# Altium schematic sheet 06 Audio-CODEC.SchDoc: CM4 IO
size 297 x 209 mm; Page Create Date: March  8, 1995; Page Number: 6; Page Size: A4; Comment: radxa_1010; Page Count: 19; RevCode: V1.10; Doc: 06 Audio-CODEC; DsnPath: D:\WMS\黄工\[RC126]CM4_IO_V1.10\[RC126]_V1.10\CM4 IO_V1.10.DSN; SchematicName: CM4 IO V1.10; PageName: 06 Audio-CODEC; PageSize: A4; TopSchematic: True
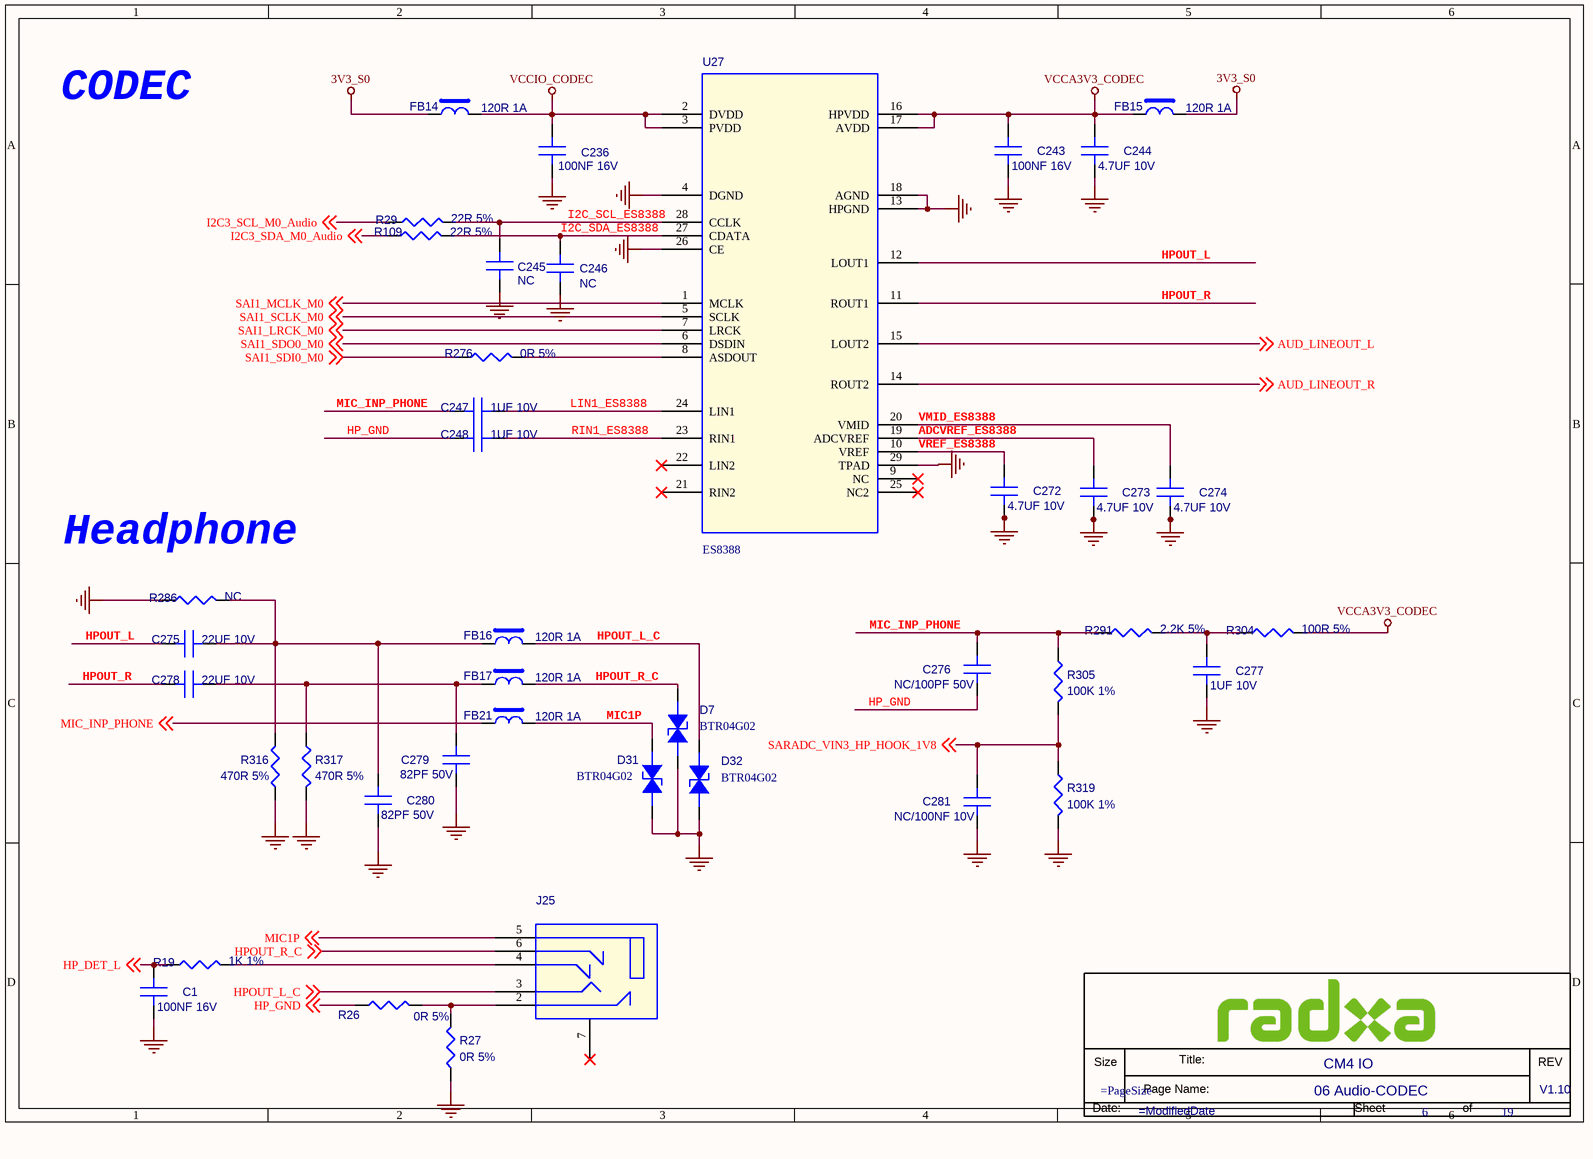
[diagram p0: 06 Audio-CODEC.SchDoc]

## Parts
*  Doc: 06 Audio-CODEC  RevCode: V1.10  Title: CM4 IO  Page Number: 6  Page Count: 19  (hidden comment: radxa_1010)  (graphical)
C1  100NF 16V  [C0201]
C236  100NF 16V  [C0201]
C243  100NF 16V  [C0201]
C244  4.7UF 10V  [C0402]
C245  NC  [C0201]
C246  NC  [C0201]
C247  1UF 10V  [C0201]
C248  1UF 10V  [C0201]
C272  4.7UF 10V  [C0402]
C273  4.7UF 10V  [C0402]
C274  4.7UF 10V  [C0402]
C275  22UF 10V  [C0603]
C276  NC/100PF 50V  [C0201]
C277  1UF 10V  [C0201]
C278  22UF 10V  [C0603]
C279  82PF 50V  [C0201]
C280  82PF 50V  [C0201]
C281  NC/100NF 10V  [C0201]
D7  BTR04G02  [DFN1006-2L]
D31  BTR04G02  [DFN1006-2L]
D32  BTR04G02  [DFN1006-2L]
FB14  120R 1A  [FB0201]
FB15  120R 1A  [FB0201]
FB16  120R 1A  [FB0201]
FB17  120R 1A  [FB0201]
FB21  120R 1A  [FB0201]
J25  (no value)  [AUDIO_SM6_LIE]
R19  1K 1%  [R0402]
R26  0R 5%  [R0402]
R27  0R 5%  [R0402]
R29  22R 5%  [R0402]
R109  22R 5%  [R0402]
R276  0R 5%  [R0402]
R286  NC  [R0402]
R291  2.2K 5%  [R0402]
R304  100R 5%  [R0402]
R305  100K 1%  [R0402]
R316  470R 5%  [R0402]
R317  470R 5%  [R0402]
R319  100K 1%  [R0402]
U27  ES8388  [QFN28_4X4]

## Nets
3V3_S0: FB14.1 FB15.1
GND: C1.2(B) C236.2(B) C243.2(B) C244.2(B) C245.2(B) C246.2(B) C272.2(B) C273.2(B) C274.2(B) C277.2(B) C279.2(B) C280.2(B) C281.2(B) D7.2(CATHODE) D31.2(CATHODE) D32.2(CATHODE) R27.1 R286.1 R316.2 R317.2 R319.2 U27.4(DGND) U27.13(HPGND) U27.18(AGND) U27.26(CE) U27.29(TPAD)
VCCA3V3_CODEC: C243.1(A) C244.1(A) FB15.2 R304.2 U27.16(HPVDD) U27.17(AVDD)
VCCIO_CODEC: C236.1(A) FB14.2 U27.2(DVDD) U27.3(PVDD)
ADCVREF_ES8388: C273.1(A) U27.19(ADCVREF)
AUD_LINEOUT_L: U27.15(LOUT2) ; off-sheet AUD_LINEOUT_L
AUD_LINEOUT_R: U27.14(ROUT2) ; off-sheet AUD_LINEOUT_R
HP_DET_L: C1.1(A) R19.1 ; off-sheet HP_DET_L
HP_GND: C248.2(B) C276.2(B) R26.1 ; off-sheet HP_GND
HPOUT_L: C275.1(A) U27.12(LOUT1)
HPOUT_L_C: D32.1(ANODE) FB16.2 J25.3(R) ; off-sheet HPOUT_L_C
HPOUT_R: C278.1(A) U27.11(ROUT1)
HPOUT_R_C: D7.1(ANODE) FB17.2 J25.6(HP) ; off-sheet HPOUT_R_C
I2C3_SCL_M0_Audio: R29.1 ; off-sheet I2C3_SCL_M0_Audio
I2C3_SDA_M0_Audio: R109.1 ; off-sheet I2C3_SDA_M0_Audio
I2C_SCL_ES8388: C245.1(A) R29.2 U27.28(CCLK)
I2C_SDA_ES8388: C246.1(A) R109.2 U27.27(CDATA)
LIN1_ES8388: C247.1(A) U27.24(LIN1)
MIC1P: D31.1(ANODE) FB21.2 J25.5(D) ; off-sheet MIC1P
MIC_INP_PHONE: C247.2(B) C276.1(A) FB21.1 R291.1 R305.1 ; off-sheet MIC_INP_PHONE
RIN1_ES8388: C248.1(A) U27.23(RIN1)
SAI1_LRCK_M0: U27.7(LRCK) ; off-sheet SAI1_LRCK_M0
SAI1_MCLK_M0: U27.1(MCLK) ; off-sheet SAI1_MCLK_M0
SAI1_SCLK_M0: U27.5(SCLK) ; off-sheet SAI1_SCLK_M0
SAI1_SDI0_M0: R276.1 ; off-sheet SAI1_SDI0_M0
SAI1_SDO0_M0: U27.6(DSDIN) ; off-sheet SAI1_SDO0_M0
SARADC_VIN3_HP_HOOK_1V8: C281.1(A) R305.2 R319.1 ; off-sheet SARADC_VIN3_HP_HOOK_1V8
VMID_ES8388: C274.1(A) U27.20(VMID)
VREF_ES8388: C272.1(A) U27.10(VREF)
NetC275_2: C275.2(B) C280.1(A) FB16.1 R286.2 R316.1
NetC277_1: C277.1(A) R291.2 R304.1
NetC278_2: C278.2(B) C279.1(A) FB17.1 R317.1
NetJ25_2: J25.2(DH) R26.2 R27.2
NetJ25_4: J25.4(L) R19.2
NetR276_2: R276.2 U27.8(ASDOUT)

Not connected (* = marked no-connect by the designer): J25 7(NC2)*; U27 9(NC)* 21(RIN2)* 22(LIN2)* 25(NC2)*

## Notes on the sheet
- CODEC
- (near R286) Headphone
- (in symbol radxa_1010) Size; Title:; REV; Page Name:; Date:; Sheet; of

## Library data of the parts
C1 = C: SMD  0201  100NF  16V  X5R  ±20%  ROHS; PARTS: 1; Part Reference: C1; Part Number: A1C01.00099; OriginalSymbolOrigin: (0,30); PKG_TYPE: CAP2-100-250; LEVEL: STD; PINSWAP: (A,B); Preferred: 6715f349cd0bc5; Value: 100NF 16V; Part Type: 陶瓷电容
C236 = C: SMD  0201  100NF  16V  X5R  ±20%  ROHS; PARTS: 1; Part Reference: C236; Part Number: A1C01.00099; OriginalSymbolOrigin: (0,30); PKG_TYPE: CAP2-100-250; LEVEL: STD; PINSWAP: (A,B); Preferred: 6715f349cd0bc5; Value: 100NF 16V; Part Type: 陶瓷电容
C243 = C: SMD  0201  100NF  16V  X5R  ±20%  ROHS; PARTS: 1; Part Reference: C243; Part Number: A1C01.00099; OriginalSymbolOrigin: (0,30); PKG_TYPE: CAP2-100-250; LEVEL: STD; PINSWAP: (A,B); Preferred: 6715f349cd0bc5; Value: 100NF 16V; Part Type: 陶瓷电容
C244 = C: SMD  0402  4.7UF  10V  X5R  ±20%  ROHS; PARTS: 1; Part Reference: C244; Part Number: A1C01.00073; OriginalSymbolOrigin: (0,30); PKG_TYPE: CAP2-100-250; LEVEL: STD; PINSWAP: (A,B); Value: 4.7UF 10V; PCB Footprint: C0402; Part Type: 陶瓷电容
C245 = C: SMD  0201  10PF  50V  NPO  ±5%  ROHS; PARTS: 1; Part Reference: C245; Part Number: A1C01.00141; OriginalSymbolOrigin: (0,30); PKG_TYPE: CAP2-100-250; LEVEL: STD; PINSWAP: (A,B); Value: NC; PCB Footprint: C0201; Part Type: 陶瓷电容
C246 = C: SMD  0201  10PF  50V  NPO  ±5%  ROHS; PARTS: 1; Part Reference: C246; Part Number: A1C01.00141; OriginalSymbolOrigin: (0,30); PKG_TYPE: CAP2-100-250; LEVEL: STD; PINSWAP: (A,B); Value: NC; PCB Footprint: C0201; Part Type: 陶瓷电容
C247 = C: SMD  0201  1UF  10V  X5R  ±20%  ROHS; PARTS: 1; Part Reference: C247; Part Number: A1C01.00081; OriginalSymbolOrigin: (0,30); PKG_TYPE: CAP2-100-250; LEVEL: STD; PINSWAP: (A,B); Value: 1UF 10V; PCB Footprint: C0201; Part Type: 陶瓷电容
C248 = C: SMD  0201  1UF  10V  X5R  ±20%  ROHS; PARTS: 1; Part Reference: C248; Part Number: A1C01.00081; OriginalSymbolOrigin: (0,30); PKG_TYPE: CAP2-100-250; LEVEL: STD; PINSWAP: (A,B); Value: 1UF 10V; PCB Footprint: C0201; Part Type: 陶瓷电容
C272 = C: SMD  0402  4.7UF  10V  X5R  ±20%  ROHS; PARTS: 1; Part Reference: C272; Part Number: A1C01.00073; OriginalSymbolOrigin: (0,30); PKG_TYPE: CAP2-100-250; LEVEL: STD; PINSWAP: (A,B); Value: 4.7UF 10V; PCB Footprint: C0402; Part Type: 陶瓷电容
C273 = C: SMD  0402  4.7UF  10V  X5R  ±20%  ROHS; PARTS: 1; Part Reference: C273; Part Number: A1C01.00073; OriginalSymbolOrigin: (0,30); PKG_TYPE: CAP2-100-250; LEVEL: STD; PINSWAP: (A,B); Value: 4.7UF 10V; PCB Footprint: C0402; Part Type: 陶瓷电容
C274 = C: SMD  0402  4.7UF  10V  X5R  ±20%  ROHS; PARTS: 1; Part Reference: C274; Part Number: A1C01.00073; OriginalSymbolOrigin: (0,30); PKG_TYPE: CAP2-100-250; LEVEL: STD; PINSWAP: (A,B); Value: 4.7UF 10V; PCB Footprint: C0402; Part Type: 陶瓷电容
C275 = C: SMD  0603  22UF  10V  X5R  ±20%  ROHS; PARTS: 1; Part Reference: C275; Part Number: A1C01.00015; OriginalSymbolOrigin: (0,30); PKG_TYPE: CAP2-100-250; LEVEL: STD; PINSWAP: (A,B); Preferred: 6715f349cd0bc5; Value: 22UF 10V; Part Type: 陶瓷电容
C276 = C: SMD  0201  100PF  50V  NPO  ±5%  ROHS; PARTS: 1; Part Reference: C276; Part Number: A1C01.00382; OriginalSymbolOrigin: (0,30); PKG_TYPE: CAP2-100-250; LEVEL: STD; PINSWAP: (A,B); Value: NC/100PF 50V; PCB Footprint: C0201; Part Type: 陶瓷电容
C277 = C: SMD  0201  1UF  10V  X5R  ±20%  ROHS; PARTS: 1; Part Reference: C277; Part Number: A1C01.00081; OriginalSymbolOrigin: (0,30); PKG_TYPE: CAP2-100-250; LEVEL: STD; PINSWAP: (A,B); Value: 1UF 10V; PCB Footprint: C0201; Part Type: 陶瓷电容
C278 = C: SMD  0603  22UF  10V  X5R  ±20%  ROHS; PARTS: 1; Part Reference: C278; Part Number: A1C01.00015; OriginalSymbolOrigin: (0,30); PKG_TYPE: CAP2-100-250; LEVEL: STD; PINSWAP: (A,B); Preferred: 6715f349cd0bc5; Value: 22UF 10V; Part Type: 陶瓷电容
C279 = C: SMD  0201  82PF  50V  COG  ±2%  ROHS; PARTS: 1; Part Reference: C279; Part Number: A1C01.00327; OriginalSymbolOrigin: (0,30); PKG_TYPE: CAP2-100-250; LEVEL: STD; PINSWAP: (A,B); Value: 82PF 50V; PCB Footprint: C0201; Part Type: 陶瓷电容
C280 = C: SMD  0201  82PF  50V  COG  ±2%  ROHS; PARTS: 1; Part Reference: C280; Part Number: A1C01.00327; OriginalSymbolOrigin: (0,30); PKG_TYPE: CAP2-100-250; LEVEL: STD; PINSWAP: (A,B); Value: 82PF 50V; PCB Footprint: C0201; Part Type: 陶瓷电容
C281 = C: SMD  0201  100NF  10V  X5R  ±20%  ROHS; PARTS: 1; Part Reference: C281; Part Number: A1C01.00009; OriginalSymbolOrigin: (0,30); PKG_TYPE: CAP2-100-250; LEVEL: STD; PINSWAP: (A,B); Value: NC/100NF 10V; PCB Footprint: C0201; Part Type: 陶瓷电容
D7 = ESD: SMD  编带  0402  BTR04G02  B-tron  ROHS; Part Reference: D7; Part Number: A1D02.00002; Parameter: ESD-台舟 ESD5341N-封装 esd0402; ID: DE-E0004; PCB Footprint: ESD_D0402; Temp Coeff: -50℃ ~ +125℃; Value: BTR04G02; Part Type: 二极管-ESD管-桥堆-TVS管
D31 = ESD: SMD  编带  0402  BTR04G02  B-tron  ROHS; Part Reference: D31; Part Number: A1D02.00002; Parameter: ESD-台舟 ESD5341N-封装 esd0402; ID: DE-E0004; PCB Footprint: ESD_D0402; Temp Coeff: -50℃ ~ +125℃; Value: BTR04G02; Part Type: 二极管-ESD管-桥堆-TVS管
D32 = ESD: SMD  编带  0402  BTR04G02  B-tron  ROHS; Part Reference: D32; Part Number: A1D02.00002; Parameter: ESD-台舟 ESD5341N-封装 esd0402; ID: DE-E0004; PCB Footprint: ESD_D0402; Temp Coeff: -50℃ ~ +125℃; Value: BTR04G02; Part Type: 二极管-ESD管-桥堆-TVS管
FB14 = BEAD: SMD  0201  FB120R  1A  MPZ0603S121HT000  ±25%  ROHS; Part Reference: FB14; Part Number: A1L09.00033; PCB Footprint: FB0201; Value: 120R 1A; Part Type: 贴片磁珠
FB15 = BEAD: SMD  0201  FB120R  1A  MPZ0603S121HT000  ±25%  ROHS; Part Reference: FB15; Part Number: A1L09.00033; PCB Footprint: FB0201; Value: 120R 1A; Part Type: 贴片磁珠
FB16 = BEAD: SMD  0201  FB120R  1A  MPZ0603S121HT000  ±25%  ROHS; Part Reference: FB16; Part Number: A1L09.00033; PCB Footprint: FB0201; Value: 120R 1A; Part Type: 贴片磁珠
FB17 = BEAD: SMD  0201  FB120R  1A  MPZ0603S121HT000  ±25%  ROHS; Part Reference: FB17; Part Number: A1L09.00033; PCB Footprint: FB0201; Value: 120R 1A; Part Type: 贴片磁珠
FB21 = BEAD: SMD  0201  FB120R  1A  MPZ0603S121HT000  ±25%  ROHS; Part Reference: FB21; Part Number: A1L09.00033; PCB Footprint: FB0201; Value: 120R 1A; Part Type: 贴片磁珠
J25 = PJ342B: SMD  XJ-DR-PJ342B-00  6PIN  外孔Φ6.0mm  内孔Φ3.6mm  前插后贴  14*6.4*H4.5MM  黑色  镀金铜头   协佳  ROHS; Part Reference: J25; Part Number: A1J10.00001; Part Type: 耳机座
R19 = R: SMD  0201  1K  1/20W  ±1%  ROHS; Part Reference: R19; Part Number: A1R01.00111; PCB Footprint: R0201; Preferred: 6715f349cd0bc5; Value: 1K 1%; Part Type: 贴片电阻
R26 = R: SMD  0201  0R  1/20W  ±5%  ROHS; Part Reference: R26; Part Number: A1R01.00027; PCB Footprint: R0201; Temp Coeff: －55℃ ~ ＋125℃; Value: 0R 5%; Part Type: 贴片电阻
R27 = R: SMD  0201  0R  1/20W  ±5%  ROHS; Part Reference: R27; Part Number: A1R01.00027; PCB Footprint: R0201; Temp Coeff: －55℃ ~ ＋125℃; Value: 0R 5%; Part Type: 贴片电阻
R29 = R: SMD  0201  22R  1/20W  ±5%  ROHS; Part Reference: R29; Part Number: A1R01.00024; PCB Footprint: R0201; Value: 22R 5%; Part Type: 贴片电阻
R109 = R: SMD  0201  22R  1/20W  ±5%  ROHS; Part Reference: R109; Part Number: A1R01.00024; PCB Footprint: R0201; Value: 22R 5%; Part Type: 贴片电阻
R276 = R: SMD  0201  0R  1/20W  ±5%  ROHS; Part Reference: R276; Part Number: A1R01.00027; PCB Footprint: R0201; Temp Coeff: －55℃ ~ ＋125℃; Value: 0R 5%; Part Type: 贴片电阻
R286 = R: SMD  0201  10K  1/20W  ±5%  ROHS; Part Reference: R286; Part Number: A1R01.00012; PCB Footprint: R0201; Temp Coeff: －55℃ ~ ＋125℃; Value: NC; Part Type: 贴片电阻
R291 = R: SMD  0201  2.2K  1/20W  ±5%  ROHS; Part Reference: R291; Part Number: A1R01.00016; PCB Footprint: R0201; Temp Coeff: －55℃ ~ ＋125℃; Value: 2.2K 5%; Part Type: 贴片电阻
R304 = R: SMD  0201  100R  1/20W  ±5%  ROHS; Part Reference: R304; Part Number: A1R01.00023; PCB Footprint: R0201; Temp Coeff: －55℃ ~ ＋125℃; Value: 100R 5%; Part Type: 贴片电阻
R305 = R: SMD  0201  100K  1/20W  ±1%  ROHS; Part Reference: R305; Part Number: A1R01.00165; Preferred: 6715f349cd0bc5; Value: 100K 1%; Part Type: 贴片电阻
R316 = R: SMD  0201  470R  1/20W  ±5%  ROHS; Part Reference: R316; Part Number: A1R01.00020; PCB Footprint: R0201; Value: 470R 5%; Part Type: 贴片电阻
R317 = R: SMD  0201  470R  1/20W  ±5%  ROHS; Part Reference: R317; Part Number: A1R01.00020; PCB Footprint: R0201; Value: 470R 5%; Part Type: 贴片电阻
R319 = R: SMD  0201  100K  1/20W  ±1%  ROHS; Part Reference: R319; Part Number: A1R01.00165; Preferred: 6715f349cd0bc5; Value: 100K 1%; Part Type: 贴片电阻
U27 = ES8388: SMD  ADC/DAC-专用型  ES8388  QFN28  Everest-semi(顺芯)  ROHS; Part Reference: U27; Part Number: A1I01.00762; PCB Footprint: QFN28_0D45_4; Value: ES8388; Part Type: 集成电路/模块
* = radxa_1010: Page Create Date: March  8, 1995; Page Size: =PageSize; Page Modify Date: =ModifiedDate